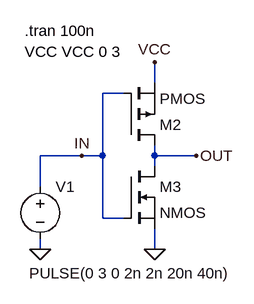
[diagram p0: schematic Fig_6-29_CMOS_NOT.asc]
Fig_6-29_CMOS_NOT.asc, the LTspice schematic file:
Version 4
SHEET 1 880 680
WIRE 224 64 224 32
WIRE 176 80 144 80
WIRE 112 176 48 176
WIRE 144 176 144 80
WIRE 144 176 112 176
WIRE 224 176 224 160
WIRE 288 176 224 176
WIRE 224 192 224 176
WIRE 48 224 48 176
WIRE 144 272 144 176
WIRE 176 272 144 272
WIRE 48 320 48 304
WIRE 224 320 224 288
FLAG 224 320 0
FLAG 288 176 OUT
FLAG 112 176 IN
FLAG 224 32 VCC
FLAG 48 320 0
SYMBOL pmos 176 160 M180
SYMATTR InstName M2
SYMBOL voltage 48 208 R0
WINDOW 3 -17 149 Left 2
WINDOW 123 0 0 Left 2
WINDOW 39 0 0 Left 2
SYMATTR Value PULSE(0 3 0 2n 2n 20n 40n)
SYMATTR InstName V1
SYMBOL nmos 176 192 R0
SYMATTR InstName M3
TEXT 24 16 Left 2 !VCC VCC 0 3
TEXT 24 -16 Left 2 !.tran 100n

The netlist it stands for:
* Fig_6-29_CMOS_NOT.asc
M2 OUT IN VCC VCC PMOS
V1 IN 0 PULSE(0 3 0 2n 2n 20n 40n)
M3 OUT IN 0 0 NMOS
.model NMOS NMOS
.model PMOS PMOS
.lib standard.mos
VCC VCC 0 3
.tran 100n
.backanno
.end